# EAGLE design led_serial_strip_hor (EAGLE 6.4)
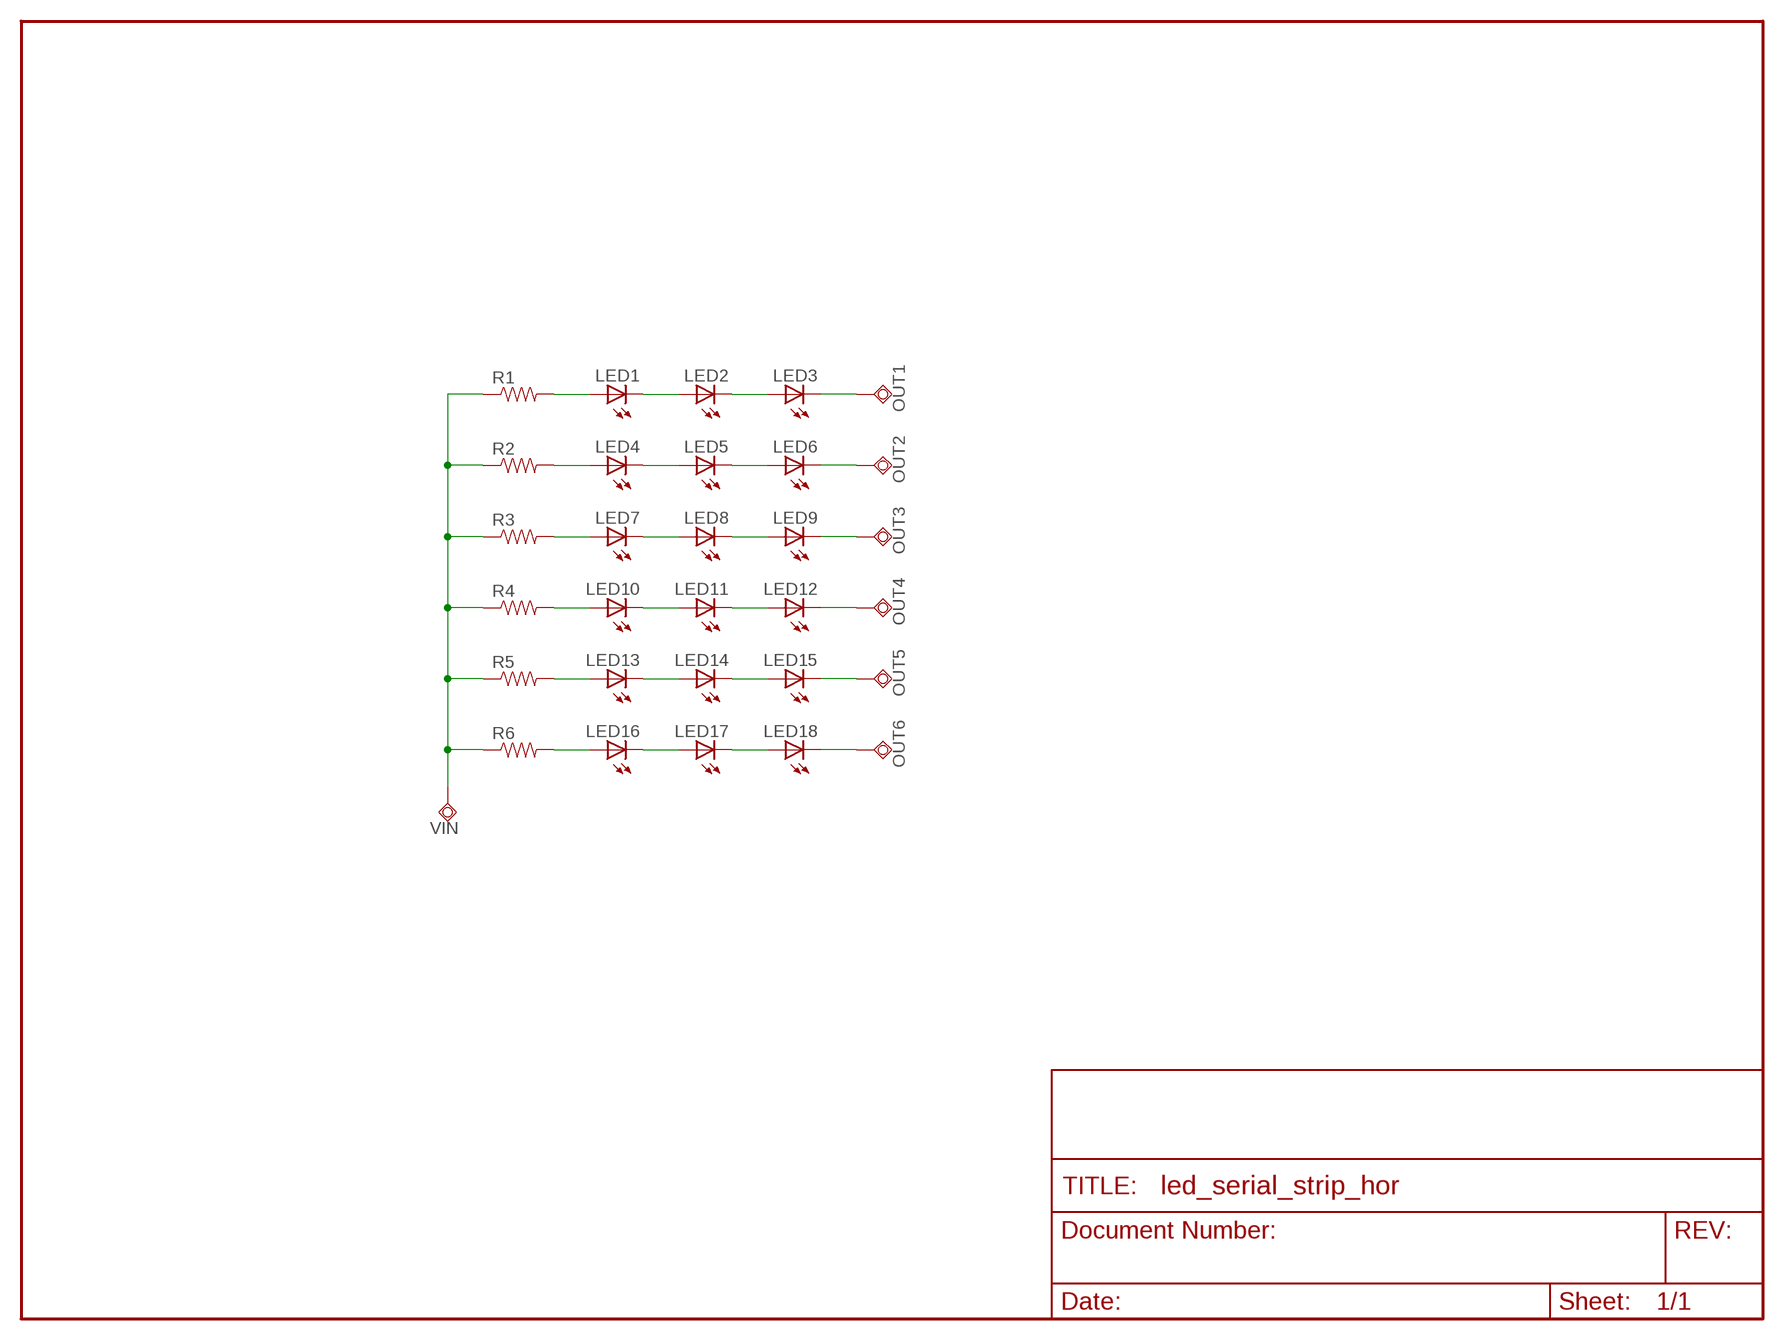
[diagram p0: schematic, sheet 1]

## Parts
LED1  LED0805  [LED_0805]
LED2  LED0805  [LED_0805]
LED3  LED0805  [LED_0805]
LED4  LED0805  [LED_0805]
LED5  LED0805  [LED_0805]
LED6  LED0805  [LED_0805]
LED7  LED0805  [LED_0805]
LED8  LED0805  [LED_0805]
LED9  LED0805  [LED_0805]
LED10  LED0805  [LED_0805]
LED11  LED0805  [LED_0805]
LED12  LED0805  [LED_0805]
LED13  LED0805  [LED_0805]
LED14  LED0805  [LED_0805]
LED15  LED0805  [LED_0805]
LED16  LED0805  [LED_0805]
LED17  LED0805  [LED_0805]
LED18  LED0805  [LED_0805]
OUT1  TPSQTP15SQ  [TP15SQ]
OUT2  TPSQTP15SQ  [TP15SQ]
OUT3  TPSQTP15SQ  [TP15SQ]
OUT4  TPSQTP15SQ  [TP15SQ]
OUT5  TPSQTP15SQ  [TP15SQ]
OUT6  TPSQTP15SQ  [TP15SQ]
R1  RESISTOR0805-RES  [0805]
R2  RESISTOR0805-RES  [0805]
R3  RESISTOR0805-RES  [0805]
R4  RESISTOR0805-RES  [0805]
R5  RESISTOR0805-RES  [0805]
R6  RESISTOR0805-RES  [0805]
VIN  TPSQTP15SQ  [TP15SQ]

## Nets
N$1: LED1.A R1.2
N$2: LED1.C LED2.A
N$3: LED2.C LED3.A
N$4: LED4.A R2.2
N$5: LED7.A R3.2
N$6: LED10.A R4.2
N$7: LED10.C LED11.A
N$8: LED11.C LED12.A
N$9: LED8.C LED9.A
N$10: LED5.C LED6.A
N$11: LED4.C LED5.A
N$12: LED7.C LED8.A
N$13: LED3.C OUT1.TP
N$14: LED6.C OUT2.TP
N$15: LED9.C OUT3.TP
N$16: LED12.C OUT4.TP
N$17: LED13.A R5.2
N$18: LED16.A R6.2
N$19: LED16.C LED17.A
N$20: LED17.C LED18.A
N$21: LED14.C LED15.A
N$22: LED13.C LED14.A
N$23: LED15.C OUT5.TP
N$24: LED18.C OUT6.TP
VIN: R1.1 R2.1 R3.1 R4.1 R5.1 R6.1 VIN.TP

## Library data of the parts
LED1-LED18 = CyberRailGuru:LED: LEDs Standard schematic elements and footprints for 5mm, 3mm, 1206, and 0603 sized LEDs. 5mm - Spark Fun Electronics SKU : COM-00529 (and others)
OUT1-OUT6 VIN = CyberRailGuru:TPSQ: Test pad
R1-R6 = SparkFun:RESISTOR: Resistor Basic schematic elements and footprints for 0603, 1206, and PTH resistors.

## Board
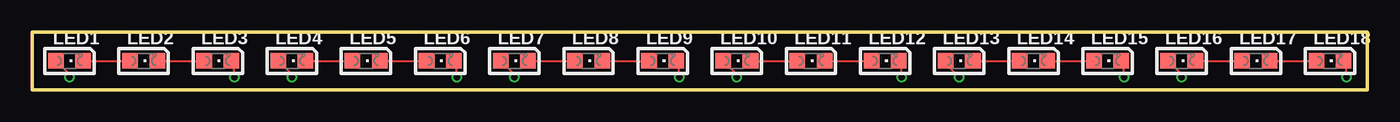
[diagram p1: board, top side]
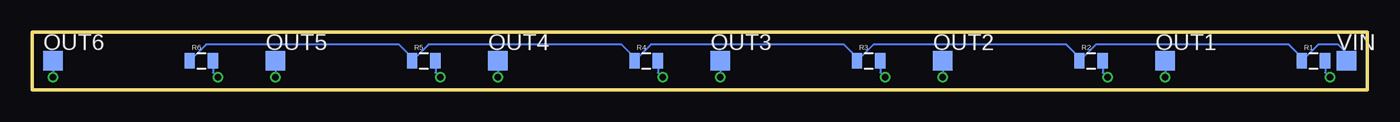
[diagram p2: board, bottom side, seen from below]

Size 102.87 x 4.43 mm. Coordinates in mm from the lower left corner, seen from the top.
Outline: 0,0 102.87,0 102.87,4.43 0,4.43 0,0
Copper layers (1*16): Top 0.035mm / dielectric 1.5mm / Bottom 0.035mm
Design rules "Fusion_eagle_rule_v1.1": minimum track width 6mil, minimum drill 12mil, track to track 6mil, track to pad 6mil, pad to pad 6mil, via to via 6mil, smd to smd 0mil, copper to edge 10mil, drill to drill 10mil, minimum pad ring 10mil, minimum via ring 6mil, stop-mask expansion 2mil, vias tented up to drill 100mil, thermal gap 10mil

### Footprints (pad centres in the part's own frame; a part is rotated, then mirrored left to right if it is on the bottom)
LED_0805 = smd 1.2 x 1.2: A 0,-1.05; C 0,1.05
TP15SQ = smd 1.5 x 1.5: TP 0,0
0805 = smd 0.8 x 1.2: 1 -0.9,0; 2 0.9,0

### Placement (x,y rotation side)
LED1  2.86,2.22 270 top
LED2  8.57,2.22 270 top
LED3  14.29,2.22 270 top
LED4  20,2.22 270 top
LED5  25.72,2.22 270 top
LED6  31.43,2.22 270 top
LED7  37.15,2.22 270 top
LED8  42.86,2.22 270 top
LED9  48.58,2.22 270 top
LED10  54.29,2.22 270 top
LED11  60.01,2.22 270 top
LED12  65.72,2.22 270 top
LED13  71.44,2.22 270 top
LED14  77.15,2.22 270 top
LED15  82.87,2.22 270 top
LED16  88.58,2.22 270 top
LED17  94.3,2.22 270 top
LED18  100.01,2.22 270 top
OUT1  15.56,2.22 0 bottom
OUT2  32.7,2.22 0 bottom
OUT3  49.85,2.22 0 bottom
OUT4  66.99,2.22 0 bottom
OUT5  84.14,2.22 0 bottom
OUT6  101.28,2.22 0 bottom
R1  4.13,2.22 0 bottom
R2  21.27,2.22 0 bottom
R3  38.42,2.22 0 bottom
R4  55.56,2.22 0 bottom
R5  72.71,2.22 0 bottom
R6  89.85,2.22 0 bottom
VIN  1.59,2.22 0 bottom

### Tracks (layer width: path | path; a pad name or v marks a point on that pad's centre or on a via)
N$1  (via drill 0.5)
  Top 0.152: v2.86,0.95 2.86,1.17 LED1.A
  Bottom 0.152: R1.2 3.23,1.32 v2.86,0.95
N$2
  Top 0.152: LED1.C LED2.A
N$3
  Top 0.152: LED2.C LED3.A
N$4  (via drill 0.5)
  Top 0.152: v20,0.95 20,1.17 LED4.A
  Bottom 0.152: R2.2 20.37,1.32 v20,0.95
N$5  (via drill 0.5)
  Top 0.152: v37.15,0.95 37.15,1.17 LED7.A
  Bottom 0.152: R3.2 37.52,1.32 v37.15,0.95
N$6  (via drill 0.5)
  Top 0.152: v54.29,0.95 54.29,1.17 LED10.A
  Bottom 0.152: R4.2 54.66,1.32 v54.29,0.95
N$7
  Top 0.152: LED10.C LED11.A
N$8
  Top 0.152: LED11.C LED12.A
N$9
  Top 0.152: LED8.C LED9.A
N$10
  Top 0.152: LED5.C LED6.A
N$11
  Top 0.152: LED4.C LED5.A
N$12
  Top 0.152: LED7.C LED8.A
N$13  (via drill 0.5)
  Top 0.152: v15.56,0.95 15.56,2 LED3.C
  Bottom 0.152: OUT1.TP v15.56,0.95
N$14  (via drill 0.5)
  Top 0.152: v32.7,0.95 32.7,2 LED6.C
  Bottom 0.152: OUT2.TP v32.7,0.95
N$15  (via drill 0.5)
  Top 0.152: v49.85,0.95 49.85,2 LED9.C
  Bottom 0.152: OUT3.TP v49.85,0.95
N$16  (via drill 0.5)
  Top 0.152: v66.99,0.95 66.99,2 LED12.C
  Bottom 0.152: OUT4.TP v66.99,0.95
N$17  (via drill 0.5)
  Top 0.152: v71.44,0.95 70.8,1.59 70.8,1.81 LED13.A
  Bottom 0.152: R5.2 71.81,1.32 v71.44,0.95
N$18  (via drill 0.5)
  Top 0.152: v88.58,0.95 88.58,1.17 LED16.A
  Bottom 0.152: R6.2 88.95,1.32 v88.58,0.95
N$19
  Top 0.152: LED16.C LED17.A
N$20
  Top 0.152: LED17.C LED18.A
N$21
  Top 0.152: LED14.C LED15.A
N$22
  Top 0.152: LED13.C LED14.A
N$23  (via drill 0.5)
  Top 0.152: v84.14,0.95 84.14,2 LED15.C
  Bottom 0.152: OUT5.TP v84.14,0.95
N$24  (via drill 0.5)
  Top 0.152: v101.28,0.95 101.28,2 LED18.C
  Bottom 0.152: OUT6.TP v101.28,0.95
VIN
  Bottom 0.152: R6.1 89.48,3.49 74.61,3.49 73.61,2.49 R5.1 72.34,3.49 57.47,3.49 56.46,2.49 R4.1 55.19,3.49 40.32,3.49 39.32,2.49 R3.1 38.05,3.49 23.18,3.49 22.17,2.49 R2.1 20.9,3.49 6.03,3.49 5.03,2.49 R1.1 3.76,3.49 2.22,3.49 1.59,2.86 VIN.TP